# Altium schematic sheet Power.SchDoc
size A; SheetNumber: 2; SheetTotal: 4
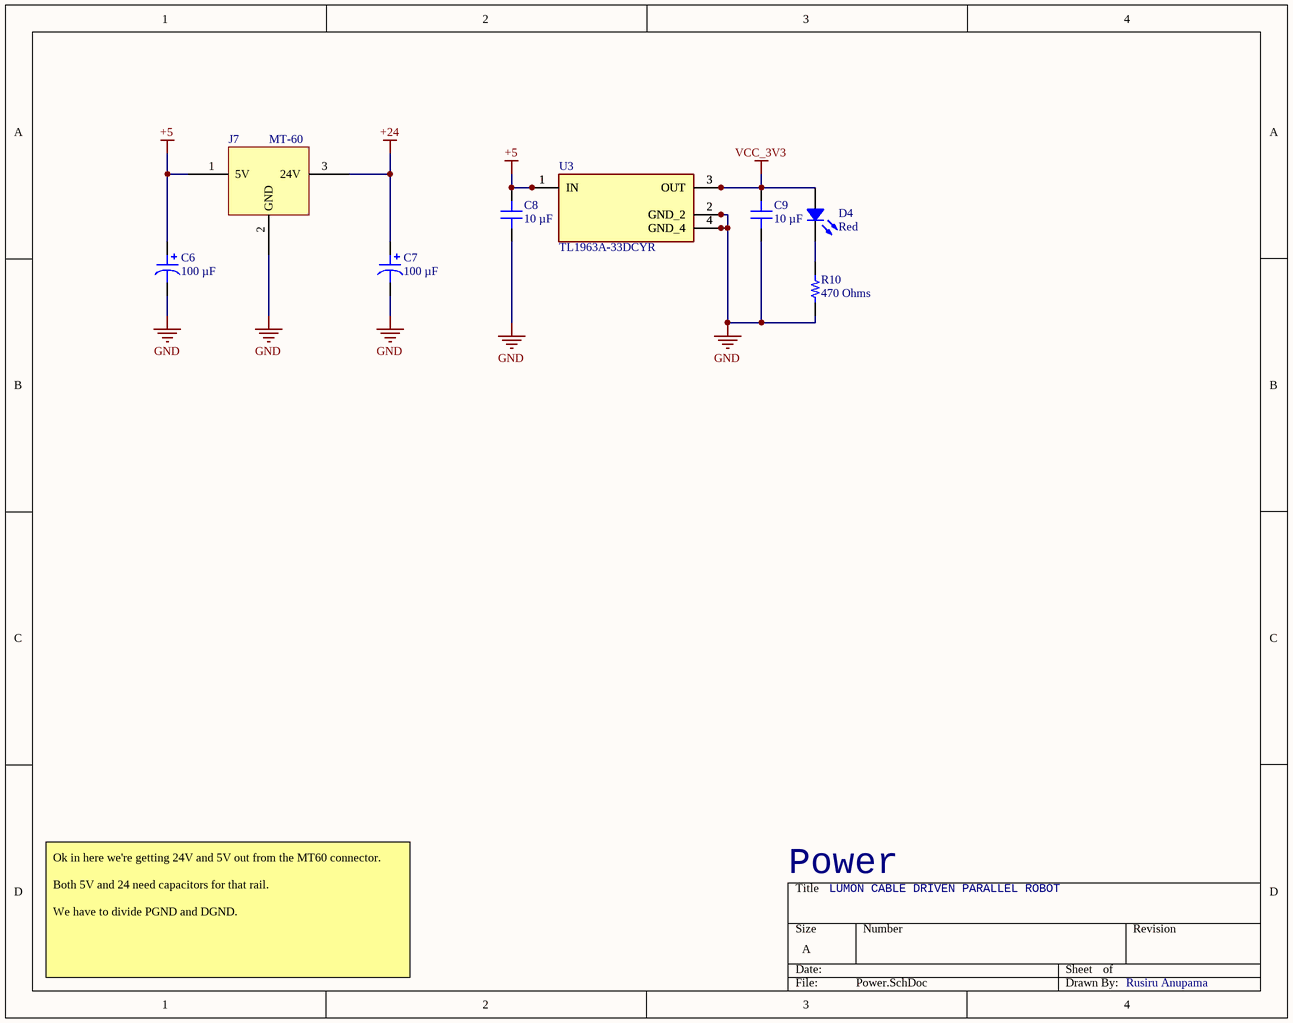
[diagram p0: Power.SchDoc]

## Parts
C6  100 µF  [CAP ALSMD 8.3MM H10.5MM]
C7  100 µF  [CAP ALSMD 8.3MM H10.5MM]
C8  10 µF  [CAP 0805_2012]
C9  10 µF  [CAP 0805_2012]
D4  Red  [LED 0805_2012 RED]
J7  MT-60  [MT-60]
R10  470 Ohms  [RES 0805_2012]
U3  TL1963A-33DCYR  [VREG_TL1963A-33DCYR]

## Nets
+5: C6.1 C8.2 J7.1(5V) U3.1(IN)
+24: C7.1 J7.3(24V)
GND: C6.2 C7.2 C8.1 C9.1 J7.2(GND) R10.1 U3.2(GND_2) U3.4(GND_4)
VCC_3V3: C9.2 D4.1 U3.3(OUT)
NetD4_2: D4.2 R10.2

## Notes on the sheet
- Power
- LUMON CABLE DRIVEN PARALLEL ROBOT
- Ok in here we're getting 24V and 5V out from the MT60 connector.
  Both 5V and 24 need capacitors for that rail.
  We have to divide PGND and DGND.
- Rusiru Anupama

## Library data of the parts
C6 C7 = 50SKV100M8X10.5: CAP ALUM 100UF 20% 50V SMD; manufacturer: Rubycon; Lifetime @ Temp.: 1000 Hrs @ 105°C; Polarization: Polar; Ripple Current @ High Frequency: 240 mA @ 10 kHz; Ripple Current @ Low Frequency: 200 mA @ 120 Hz; Surface Mount Land Size: 0.327" L x 0.327" W (8.30mm x 8.30mm); Part Number: 50SKV100M8X10.5; Applications: General Purpose; Capacitance: 100 µF; componentlink1description: Datasheet; componentlink1url: http://www.rubycon.co.jp/en/catalog/e_pdfs/aluminum/e_SKV.pdf; componentlink2description: DigiKey Link; componentlink2url: https://www.digikey.com/en/products/detail/rubycon/50SKV100M8X10-5/3568726; Device Package: Radial, Can - SMD; Height - Seated (Max): 0.413" (10.50mm); lastupdated: 4/5/2026 8:53:56 PM; Lifecycle Status: Active; Minimum Order: 1; Mounting Type: Surface Mount; Operating Temperature: -55°C ~ 105°C; Package / Case: Radial, Can - SMD; packaging: TapeAndReel; partid: 7600; Part Status: Active; price: 0.17; series: SKV; Size / Dimension: 0.315" Dia (8.00mm); Supplier 1: DigiKey; Supplier Part Number 1: 1189-3108-1-ND; Tolerance: ±20%; value: 100 µF; Voltage - Rated: 50 V; LCSC part #: C2983550
C8 C9 = CL21Y106KPQVPNE: CAP CER 10UF 10V X7S 0805; manufacturer: Samsung Electro-Mechanics; Tolerance: ±10%; Part Number: CL21Y106KPQVPNE; Capacitance: 10 µF; Applications: Automotive; componentlink1description: Datasheet; componentlink1url: http://www.samsungsem.com/kr/support/product-search/mlcc/CL21Y106KPQVPNE.jsp; componentlink2description: DigiKey Link; componentlink2url: https://www.digikey.com/en/products/detail/samsung-electro-mechanics/CL21Y106KPQVPNE/5961169; Device Package: 0805 (2012 Metric); Features: General Purpose; lastupdated: 4/6/2026 7:33:17 PM; Lifecycle Status: Active; Minimum Order: 1; Mounting Type: Surface Mount, MLCC, Epoxy; Operating Temperature: -55°C ~ 125°C; Package / Case: 0805 (2012 Metric); packaging: TapeAndReel; partid: 2979; Part Status: Active; price: 0.06; Ratings: AEC-Q200; series: CL; Size / Dimension: 0.079" L x 0.049" W (2.00mm x 1.25mm); Supplier 1: DigiKey; Supplier Part Number 1: 1276-6685-1-ND; Temperature Coefficient: X7S; Thickness (Max): 0.055" (1.40mm); value: 10 µF; Voltage - Rated: 10V; LCSC part #: C32635
D4 = 5990110007F: LED RED 0805 SMD; Manufacturer: Dialight; Configuration: Standard; Current - Test: 20mA; Lens Color: 0.80mm; Lens Size: 1.40mm x 1.25mm; Lens Style: Rectangle with Flat Top; Millicandela Rating: 29mcd; Viewing Angle: 140°; Voltage - Forward (Vf) (Typ): 2.1V; Wavelength - Dominant: 633nm; Part Number: 5990110007F; Color: Red; ComponentLink1Description: Datasheet; ComponentLink1URL: http://www.dialightsignalsandcomponents.com/Assets/Brochures_And_Catalogs/Indication/CBI_SMD_new/Dialight_CBI_data_599-0805_Apr2018.pdf; ComponentLink2Description: DigiKey Link; ComponentLink2URL: https://www.digikey.com/en/products/detail/dialight/5990110007F/9385408; Device Package: 0805 (2012 Metric); Height (Max): 0.80mm; LastUpdated: 4/5/2026 8:38:27 PM; Lifecycle Status: Active; Minimum Order: 1; Mounting Type: Surface Mount; Package / Case: 0805 (2012 Metric); Packaging: TapeAndReel; PartId: 308; Part Status: Active; Price: 0.04; Series: 599; Size / Dimension: 2.00mm L x 1.25mm W; Supplier 1: DigiKey; Supplier Part Number 1: 350-4353-1-ND; Supplier Device Package: 0805; Value: Red; LCSC part #: C19171391
R10 = ERJ-PB6B4700V: RES SMD 470 OHM 0.1% 1/4W 0805; Manufacturer: Panasonic Electronic Components; Power (Watts): 0.25W, 1/4W; Temperature Coefficient: ±50ppm/°C; Part Number: ERJ-PB6B4700V; Value: 470 Ohms; ComponentLink1Description: Datasheet; ComponentLink1URL: https://industrial.panasonic.com/cdbs/www-data/pdf/RDM0000/AOA0000C328.pdf; ComponentLink2Description: DigiKey Link; ComponentLink2URL: https://www.digikey.com/en/products/detail/panasonic-electronic-components/ERJ-PB6B4700V/6213339; Composition: Thick Film; Device Package: 0805 (2012 Metric); Features: Automotive AEC-Q200; Height - Seated (Max): 0.028" (0.70mm); LastUpdated: 4/5/2026 8:11:23 PM; Lifecycle Status: Active; Minimum Order: 1; Number of Terminations: 2; Operating Temperature: -55°C ~ 155°C; Package / Case: 0805 (2012 Metric); Packaging: TapeAndReel; PartId: 28402; Part Status: Active; Price: 0.04; Ratings: AEC-Q200; Resistance: 470 Ohms; Series: ERJ-PB6; Size / Dimension: 0.079" L x 0.049" W (2.00mm x 1.25mm); Supplier 1: DigiKey; Supplier Part Number 1: P20556CT-ND; Supplier Device Package: 0805; Tolerance: ±0.1%; LCSC part #: C441978
U3 = TL1963A-33DCYR: 1.5-A, 20-V, low-dropout voltage regulator with reverse current & reverse voltage protection; MF: Texas Instruments; SnapEDA_Link: https://www.snapeda.com/parts/TL1963A-33DCYR/Texas+Instruments/view-part/?ref=snap; Package: SOT-223-4 Texas Instruments; Value: *; MP: TL1963A-33DCYR; Check_prices: https://www.snapeda.com/parts/TL1963A-33DCYR/Texas+Instruments/view-part/?ref=eda; LCSC part #: C181262
J7 = MT-60: LCSC part #: C99176